# EasyEDA schematic SCH_Aether Zero_R0.4.json
TITLE: Aether Zero; REV: 0.4; Date: 2023-12-19; Sheet: 1/1; Drawn By: averseabfun; Company: (none)
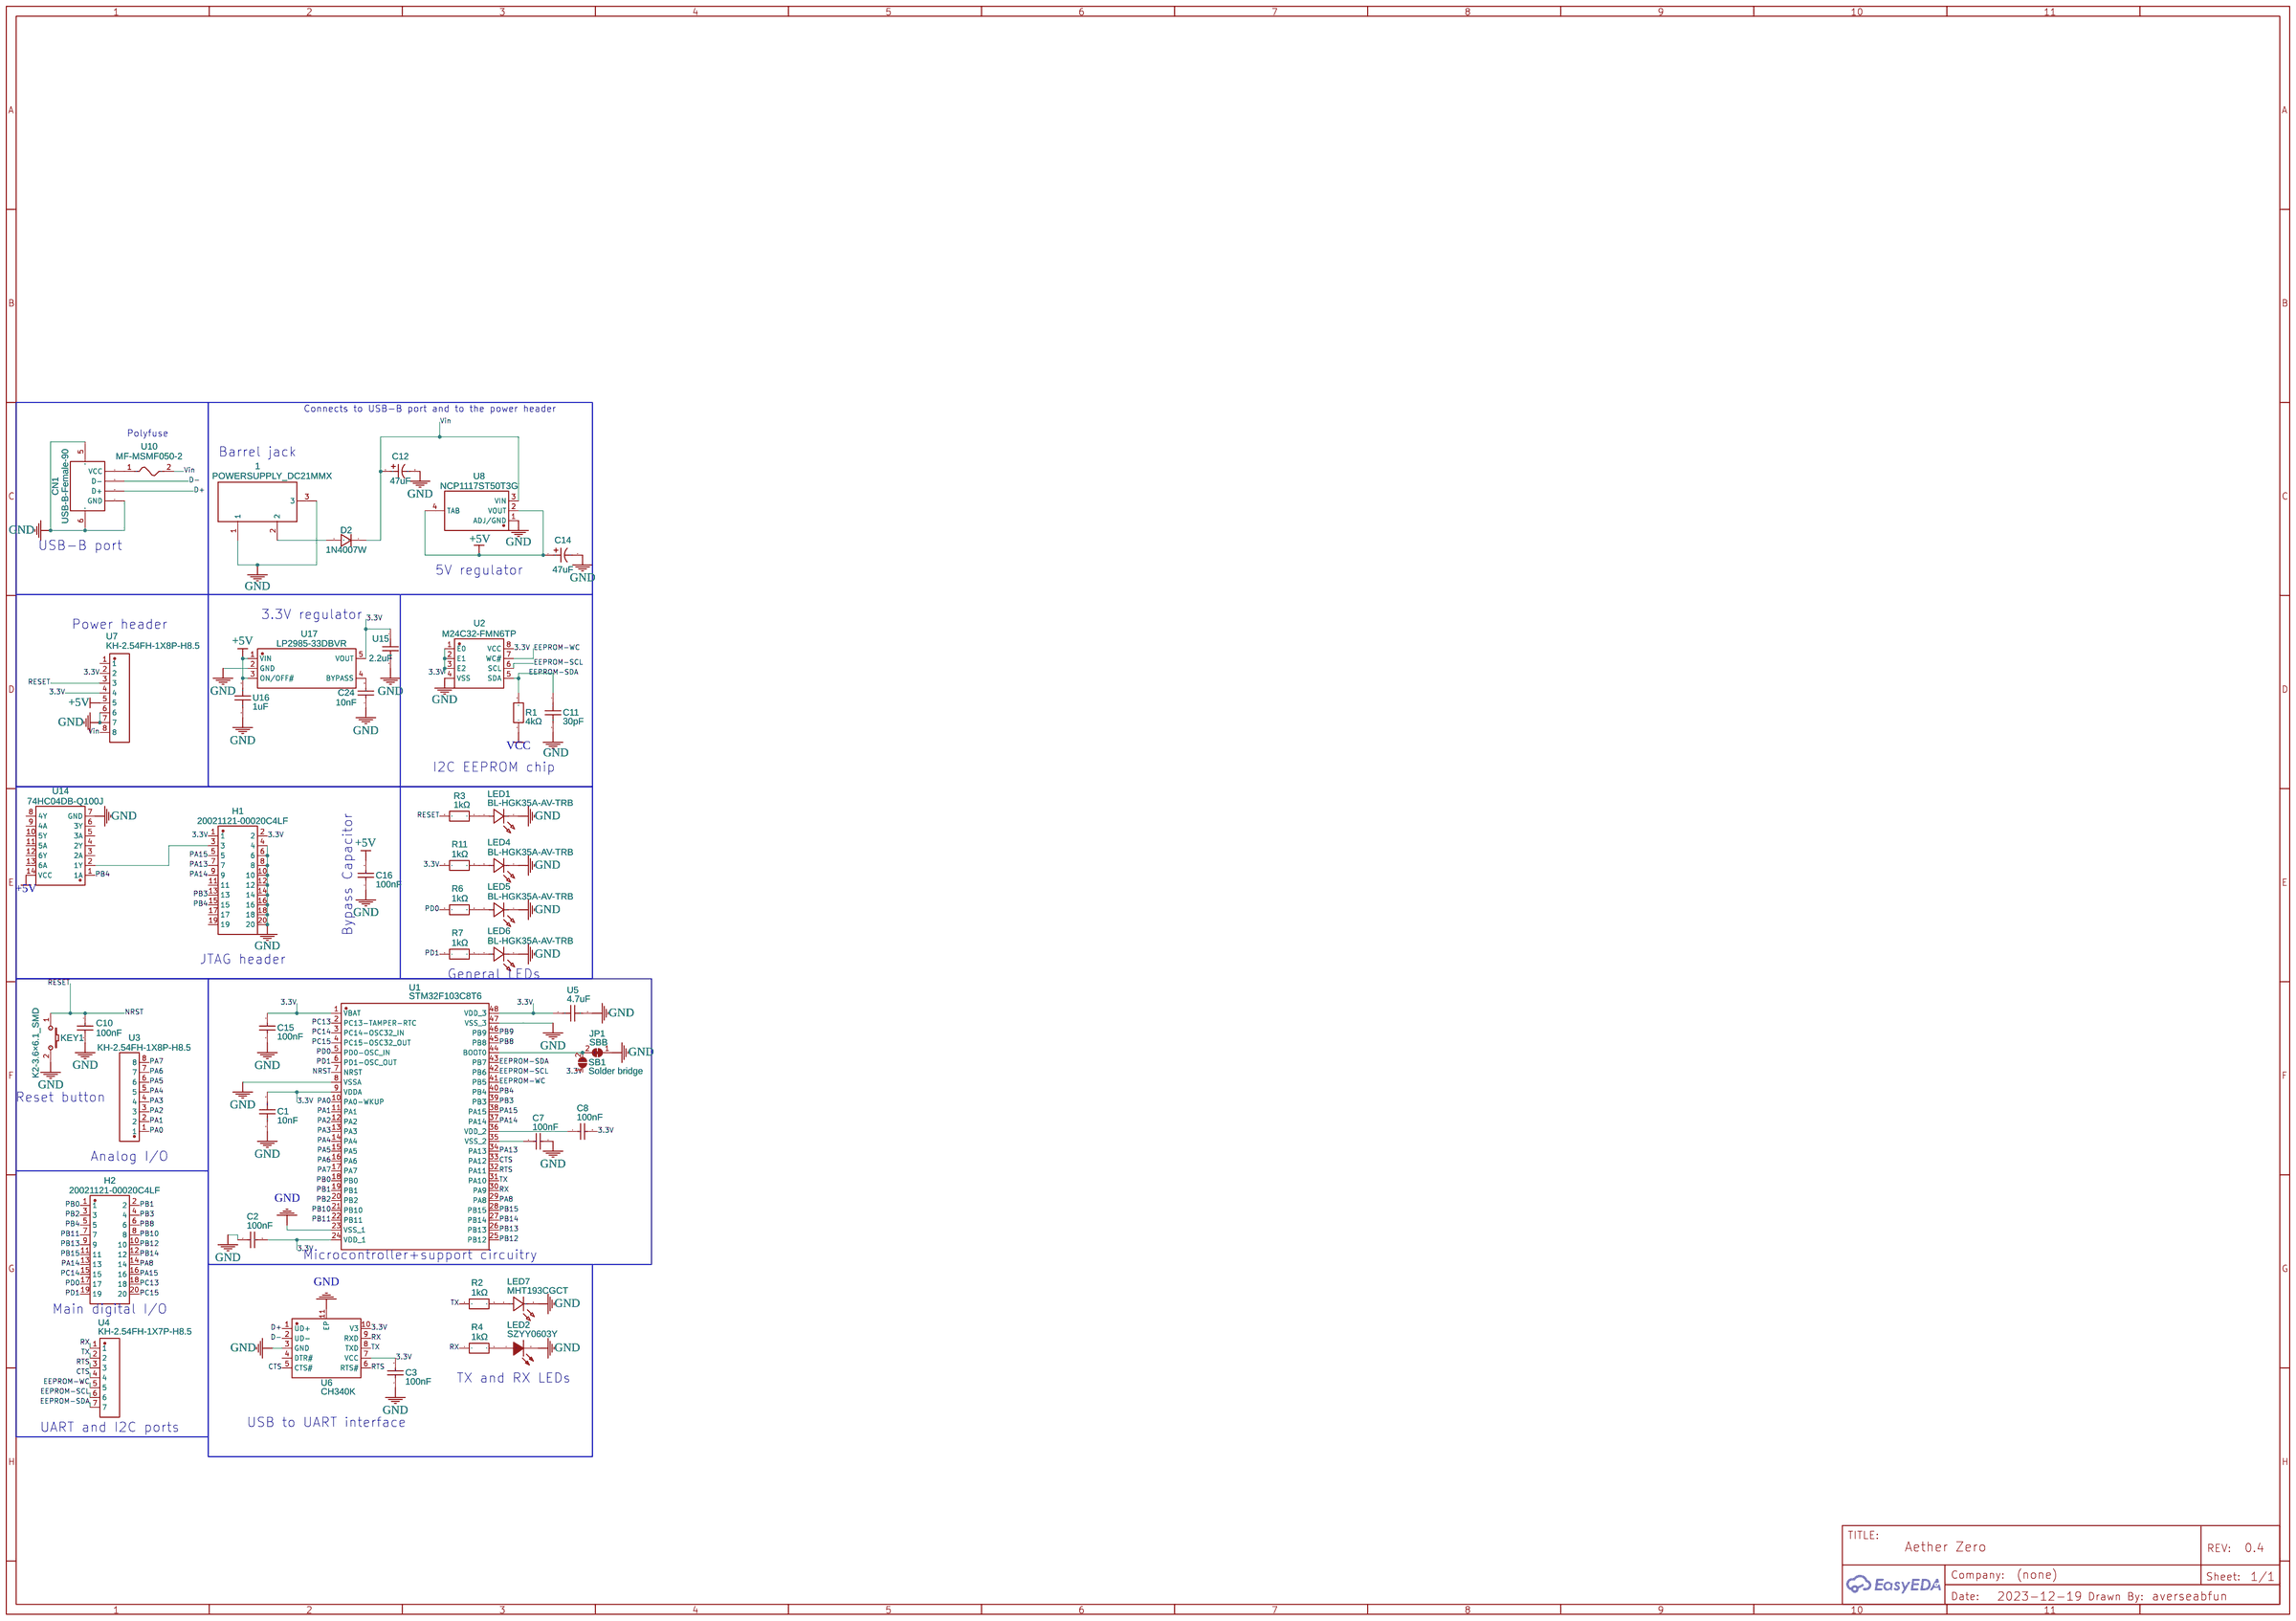
[diagram p0: schematic sheet]

## Parts
1  POWERSUPPLY_DC21MMX  [POWERSUPPLY_DC-21MM]
C1  10nF  [C0805]
C2  100nF  [C0402]
C3  100nF  [C0402]
C7  100nF  [C0402]
C8  100nF  [C0402]
C10  100nF  [C0402]
C11  30pF  [C0402]
C12  47uF  [CAP-SMD_BD6.3-L6.6-W6.6-LS7.2-FD]
C14  47uF  [CAP-SMD_BD6.3-L6.6-W6.6-LS7.2-FD]
C15  100nF  [C0402]
C16  100nF  [C0402]
C24  10nF  [C0402]
CN1  USB-B-Female-90  [USB-B_TH_USB-B-FEMALE-90]
D2  1N4007W  [SOD-123_L2.8-W1.8-LS3.7-RD]
H1  20021121-00020C4LF  [HDR-SMD_20P-P1.27-V-M-R2-C10-S1.27-LS5.5-1]
H2  20021121-00020C4LF  [HDR-SMD_20P-P1.27-V-M-R2-C10-S1.27-LS5.5-1]
JP1  SBB  [SOLDER BRIDGE 2P BRIDGED]
KEY1  K2-3.6×6.1_SMD  [KEY-SMD_2P-L6.2-W3.6-LS8.0]
LED1  BL-HGK35A-AV-TRB  [LED0805-RD_GREEN]
LED2  SZYY0603Y  [LED0603-R-RD-YELLOW]
LED4  BL-HGK35A-AV-TRB  [LED0805-RD_GREEN]
LED5  BL-HGK35A-AV-TRB  [LED0805-RD_GREEN]
LED6  BL-HGK35A-AV-TRB  [LED0805-RD_GREEN]
LED7  MHT193CGCT  [LED0603-RD_GREEN]
R1  4kΩ  [R1206]
R2  1kΩ  [R0603]
R3  1kΩ  [R0603]
R4  1kΩ  [R0603]
R6  1kΩ  [R0603]
R7  1kΩ  [R0603]
R11  1kΩ  [R0603]
SB1  Solder bridge  [SOLDER BRIDGE 2P UNBRIDGED]
U1  STM32F103C8T6  [LQFP-48_L7.0-W7.0-P0.50-LS9.0-BL]
U2  M24C32-FMN6TP  [SO-8_L4.9-W3.9-P1.27-LS6.0-BL]
U3  KH-2.54FH-1X8P-H8.5  [HDR-TH_8P-P2.54-V-F]
U4  KH-2.54FH-1X7P-H8.5  [HDR-TH_7P-P2.54-V-F]
U5  4.7uF  [C0603]
U6  CH340K  [ESOP-10_L4.9-W3.9-P1.00-LS6.2-BL-EP]
U7  KH-2.54FH-1X8P-H8.5  [HDR-TH_8P-P2.54-V-F]
U8  NCP1117ST50T3G  [SOT-223_L6.5-W3.5-P2.30-LS7.0-BR]
U10  MF-MSMF050-2  [F1812]
U14  74HC04DB-Q100J  [SSOP-14_L6.2-W5.3-P0.65-LS7.8-BL]
U15  2.2uF  [C0805]
U16  1uF  [C1206]
U17  LP2985-33DBVR  [SOT-23-5_L2.9-W1.6-P0.95-LS2.8-TL]

## Library data of the parts
1 = POWERSUPPLY_DC21MMX: Contributor: joserbraga
C1 = CC0805KRX7R8BB103: Contributor: LCSC; Supplier: LCSC; Supplier Part: C519911; Manufacturer: YAGEO(国巨); JLCPCB Part Class: Extended Part
C2 C3 C7 C8 C10 C15 C16 = 0402B104K160NT: Supplier: LCSC; Manufacturer: FH(风华); Supplier Part: C41851; JLCPCB Part Class: Extended Part; link: https://lcsc.com/eda_search?q=C41851&%26type=1&ref=editor
C11 = AC0402JRNPO9BN300: Contributor: LCSC; Supplier: LCSC; Supplier Part: C726127; Manufacturer: YAGEO(国巨); JLCPCB Part Class: Extended Part
C12 C14 = RVT47UF35V67RV0039: Contributor: LCSC; Supplier: LCSC; Supplier Part: C2836440; Manufacturer: KNSCHA(科尼盛); JLCPCB Part Class: Extended Part; link: https://lcsc.com/eda_search?q=C2836440&%26type=1&ref=editor
C24 = 0402B103K500NT: Supplier: LCSC; Manufacturer: FH(风华); Supplier Part: C1524; JLCPCB Part Class: Extended Part
CN1 = USB-B-Female-90: Supplier: LCSC; Manufacturer: 精拓金; Manufacturer Part: 921-111A1010D10200; Supplier Part: C46392; JLCPCB Part Class: Extended Part; link: https://lcsc.com/eda_search?q=C46392&%26type=1&ref=editor
D2 = 1N4007W: Supplier: LCSC; Supplier Part: C328592; Manufacturer: BLUE ROCKET; Contributor: LCEDA_Lib
H1 H2 = 20021121-00020C4LF: Contributor: LCSC; Supplier: LCSC; Supplier Part: C239061; Manufacturer: Amphenol; JLCPCB Part Class: Extended Part
JP1 = SBB: Contributor: Giovanni Lenzi
KEY1 = K2-3.6×6.1_SMD: Supplier Part: C118141; Supplier: LCSC; Manufacturer Part: K2-1107ST-A4SW-06; Contributor: LCEDA_Lib; 制造商: 韩国韩荣
LED1 LED4-LED6 = BL-HGK35A-AV-TRB: Contributor: lcsc; Supplier: LCSC; Supplier Part: C5123492; Manufacturer: BrtLed(佰鸿); JLCPCB Part Class: Extended Part; link: https://lcsc.com/eda_search?q=C5123492&%26type=1&ref=editor
LED2 = SZYY0603Y: Contributor: LCSC; Supplier: LCSC; Supplier Part: C434424; Manufacturer: yongyu(永裕光电); JLCPCB Part Class: Extended Part
LED7 = MHT193CGCT: Contributor: lcsc; Supplier: LCSC; Supplier Part: C2962098; Manufacturer: MEIHUA(美华); JLCPCB Part Class: Extended Part
R1 = RN732BTTD4001B25: Contributor: LCSC; Supplier: LCSC; Supplier Part: C782230; Manufacturer: KOA; JLCPCB Part Class: Extended Part
R2-R4 R6 R7 R11 = CR-03JA7----1K: Contributor: LCSC; Supplier: LCSC; Supplier Part: C881898; Manufacturer: Viking Tech; JLCPCB Part Class: Extended Part; link: https://lcsc.com/eda_search?q=C881898&%26type=1&ref=editor
SB1 = Solder bridge: Contributor: pipizl8981; Manufacturer Part: DNP; Manufacturer: DNP
U1 = STM32F103C8T6: Supplier: LCSC; Manufacturer: ST(意法半导体); Supplier Part: C8734; JLCPCB Part Class: Basic Part
U2 = M24C32-FMN6TP: Contributor: LCSC; Supplier: LCSC; Supplier Part: C2061453; Manufacturer: ST(意法半导体); JLCPCB Part Class: Extended Part
U3 U7 = KH-2.54FH-1X8P-H8.5: Contributor: LCSC; Supplier: LCSC; Supplier Part: C2905417; Manufacturer: kinghelm(金航标); JLCPCB Part Class: Extended Part; link: https://lcsc.com/eda_search?q=C2905417&%26type=1&ref=editor
U4 = KH-2.54FH-1X7P-H8.5: Contributor: LCSC; Supplier: LCSC; Supplier Part: C2932672; Manufacturer: kinghelm(金航标); JLCPCB Part Class: Extended Part
U5 = CSA0603X5R475K6R3JT: Contributor: lcsc; Supplier: LCSC; Supplier Part: C3015159; Manufacturer: HRE(芯声); JLCPCB Part Class: Extended Part
U6 = CH340K: Contributor: LCSC; Supplier: LCSC; Supplier Part: C968586; Manufacturer: WCH(南京沁恒); JLCPCB Part Class: Extended Part
U8 = NCP1117ST50T3G: Supplier: LCSC; Manufacturer: onsemi(安森美); Supplier Part: C17314; JLCPCB Part Class: Extended Part; link: https://lcsc.com/eda_search?q=C17314&%26type=1&ref=editor
U10 = MF-MSMF050-2: Supplier: LCSC; Manufacturer: BOURNS; Supplier Part: C17313; JLCPCB Part Class: Extended Part; link: https://lcsc.com/eda_search?q=C17313&%26type=1&ref=editor
U14 = 74HC04DB-Q100J: Contributor: LCSC; Supplier: LCSC; Supplier Part: C546498; Manufacturer: Nexperia(安世); JLCPCB Part Class: Extended Part
U15 = 0805X225K250CT_C5122273: Contributor: lcsc; Supplier: LCSC; Supplier Part: C5122273; Manufacturer: Walsin(华新科); Manufacturer Part: 0805X225K250CT; JLCPCB Part Class: Extended Part
U16 = CGA5L3X8R1H105KT0Y0N: Contributor: lcsc; Supplier: LCSC; Supplier Part: C342628; Manufacturer: TDK; JLCPCB Part Class: Extended Part
U17 = LP2985-33DBVR: Supplier: LCSC; Manufacturer: TI(德州仪器); Supplier Part: C95414; JLCPCB Part Class: Extended Part; link: https://lcsc.com/eda_search?q=C95414&%26type=1&ref=editor

## Nets
3.3V: C1.2 C2.2 C3.2 C8.2 C15.1 H1.1 H1.2 R11.1 SB1.1(A) U1.1(VBAT) U1.9(VDDA) U1.24(VDD_1) U1.48(VDD_3) U2.1(E0) U2.2(E1) U2.3(E2) U2.8(VCC) U5.1 U6.7(VCC) U6.10(V3) U7.2 U7.4 U15.1 U17.5(VOUT)
+5V: C14.1 C16.2 U7.5 U8.2(VOUT) U8.4(TAB) U14.14(VCC) U16.2 U17.1(VIN) U17.3(ON/OFF#)
GND: 1.1 1.3 C1.1 C2.1 C3.1 C7.2 C10.2 C11.2 C12.2 C14.2 C15.2 C16.1 C24.1 CN1.4(GND) CN1.5(SH1) CN1.6(SH2) H1.4 H1.6 H1.8 H1.10 H1.12 H1.14 H1.16 H1.18 H1.20 JP1.1(A) KEY1.2 LED1.1(K) LED2.2(-) LED4.1(K) LED5.1(K) LED6.1(K) LED7.1(K) U1.8(VSSA) U1.23(VSS_1) U1.47(VSS_3) U2.4(VSS) U5.2 U6.3(GND) U6.11(EP) U7.6 U7.7 U8.1(ADJ/GND) U14.7(GND) U15.2 U16.1 U17.2(GND)
VCC: R1.1
Vin: C12.1 D2.1 U7.8 U8.3(VIN) U10.2
CTS: U1.33(PA12) U4.4 U6.5(CTS#)
D+: CN1.3(D+) U6.1(UD+)
D-: CN1.2(D-) U6.2(UD-)
EEPROM-SCL: U1.42(PB6) U2.6(SCL) U4.6
EEPROM-SDA: C11.1 R1.2 U1.43(PB7) U2.5(SDA) U4.7
EEPROM-WC: U1.41(PB5) U2.7(WC#) U4.5
NRST: C10.1 KEY1.1 R3.2 U1.7(NRST) U7.3
PA0: U1.10(PA0-WKUP) U3.1
PA1: U1.11(PA1) U3.2
PA2: U1.12(PA2) U3.3
PA3: U1.13(PA3) U3.4
PA4: U1.14(PA4) U3.5
PA5: U1.15(PA5) U3.6
PA6: U1.16(PA6) U3.7
PA7: U1.17(PA7) U3.8
PA8: H2.14 U1.29(PA8)
PA13: H1.7 U1.34(PA13)
PA14: H1.9 H2.13 U1.37(PA14)
PA15: H1.5 H2.16 U1.38(PA15)
PB0: H2.1 U1.18(PB0)
PB1: H2.2 U1.19(PB1)
PB2: H2.3 U1.20(PB2)
PB3: H1.13 H2.4 U1.39(PB3)
PB4: H1.15 H2.5 U1.40(PB4) U14.1(1A)
PB8: H2.6 U1.45(PB8)
PB9: U1.46(PB9)
PB10: H2.8 U1.21(PB10)
PB11: H2.7 U1.22(PB11)
PB12: H2.10 U1.25(PB12)
PB13: H2.9 U1.26(PB13)
PB14: H2.12 U1.27(PB14)
PB15: H2.11 U1.28(PB15)
PC13: H2.18 U1.2(PC13-TAMPER-RTC)
PC14: H2.15 U1.3(PC14-OSC32_IN)
PC15: H2.20 U1.4(PC15-OSC32_OUT)
PD0: H2.17 R6.1 U1.5(PD0-OSC_IN)
PD1: H2.19 R7.1 U1.6(PD1-OSC_OUT)
RTS: U1.32(PA11) U4.3 U6.6(RTS#)
RX: R4.1 U1.30(PA9) U4.1 U6.9(RXD)
TX: R2.1 U1.31(PA10) U4.2 U6.8(TXD)
Net-(1-2): 1.2 D2.2
Net-(C7-1): C7.1 U1.35(VSS_2)
Net-(C8-1): C8.1 U1.36(VDD_2)
Net-(C24-2): C24.2 U17.4(BYPASS)
Net-(CN1-1): CN1.1(VCC) U10.1
Net-(H1-3): H1.3 U14.2(1Y)
Net-(JP1-2): JP1.2(B) SB1.2(B) U1.44(BOOT0)
Net-(LED1-2): LED1.2(A) R3.1
Net-(LED2-1): LED2.1(+) R4.2
Net-(LED4-2): LED4.2(A) R11.2
Net-(LED5-2): LED5.2(A) R6.2
Net-(LED6-2): LED6.2(A) R7.2
Net-(LED7-2): LED7.2(A) R2.2

Not connected (* = marked no-connect by the designer): H1 11 17 19; U6 4(DTR#); U7 1; U14 3(2A) 4(2Y) 5(3A) 6(3Y) 8(4Y) 9(4A) 10(5Y) 11(5A) 12(6Y) 13(6A)

## Notes on the sheet
- Connects to USB-B port and to the power header
- Polyfuse
- Barrel jack
- USB-B port
- 5V regulator
- 3.3V regulator
- Power header
- I2C EEPROM chip
- Bypass Capacitor
- JTAG header
- General LEDs
- Reset button
- Analog I/O
- Microcontroller+support circuitry
- Main digital I/O
- TX and RX LEDs
- UART and I2C ports
- USB to UART interface
